# EAGLE design O2_PROM_ISP_FFC_L_A00 (EAGLE 9.6.2)
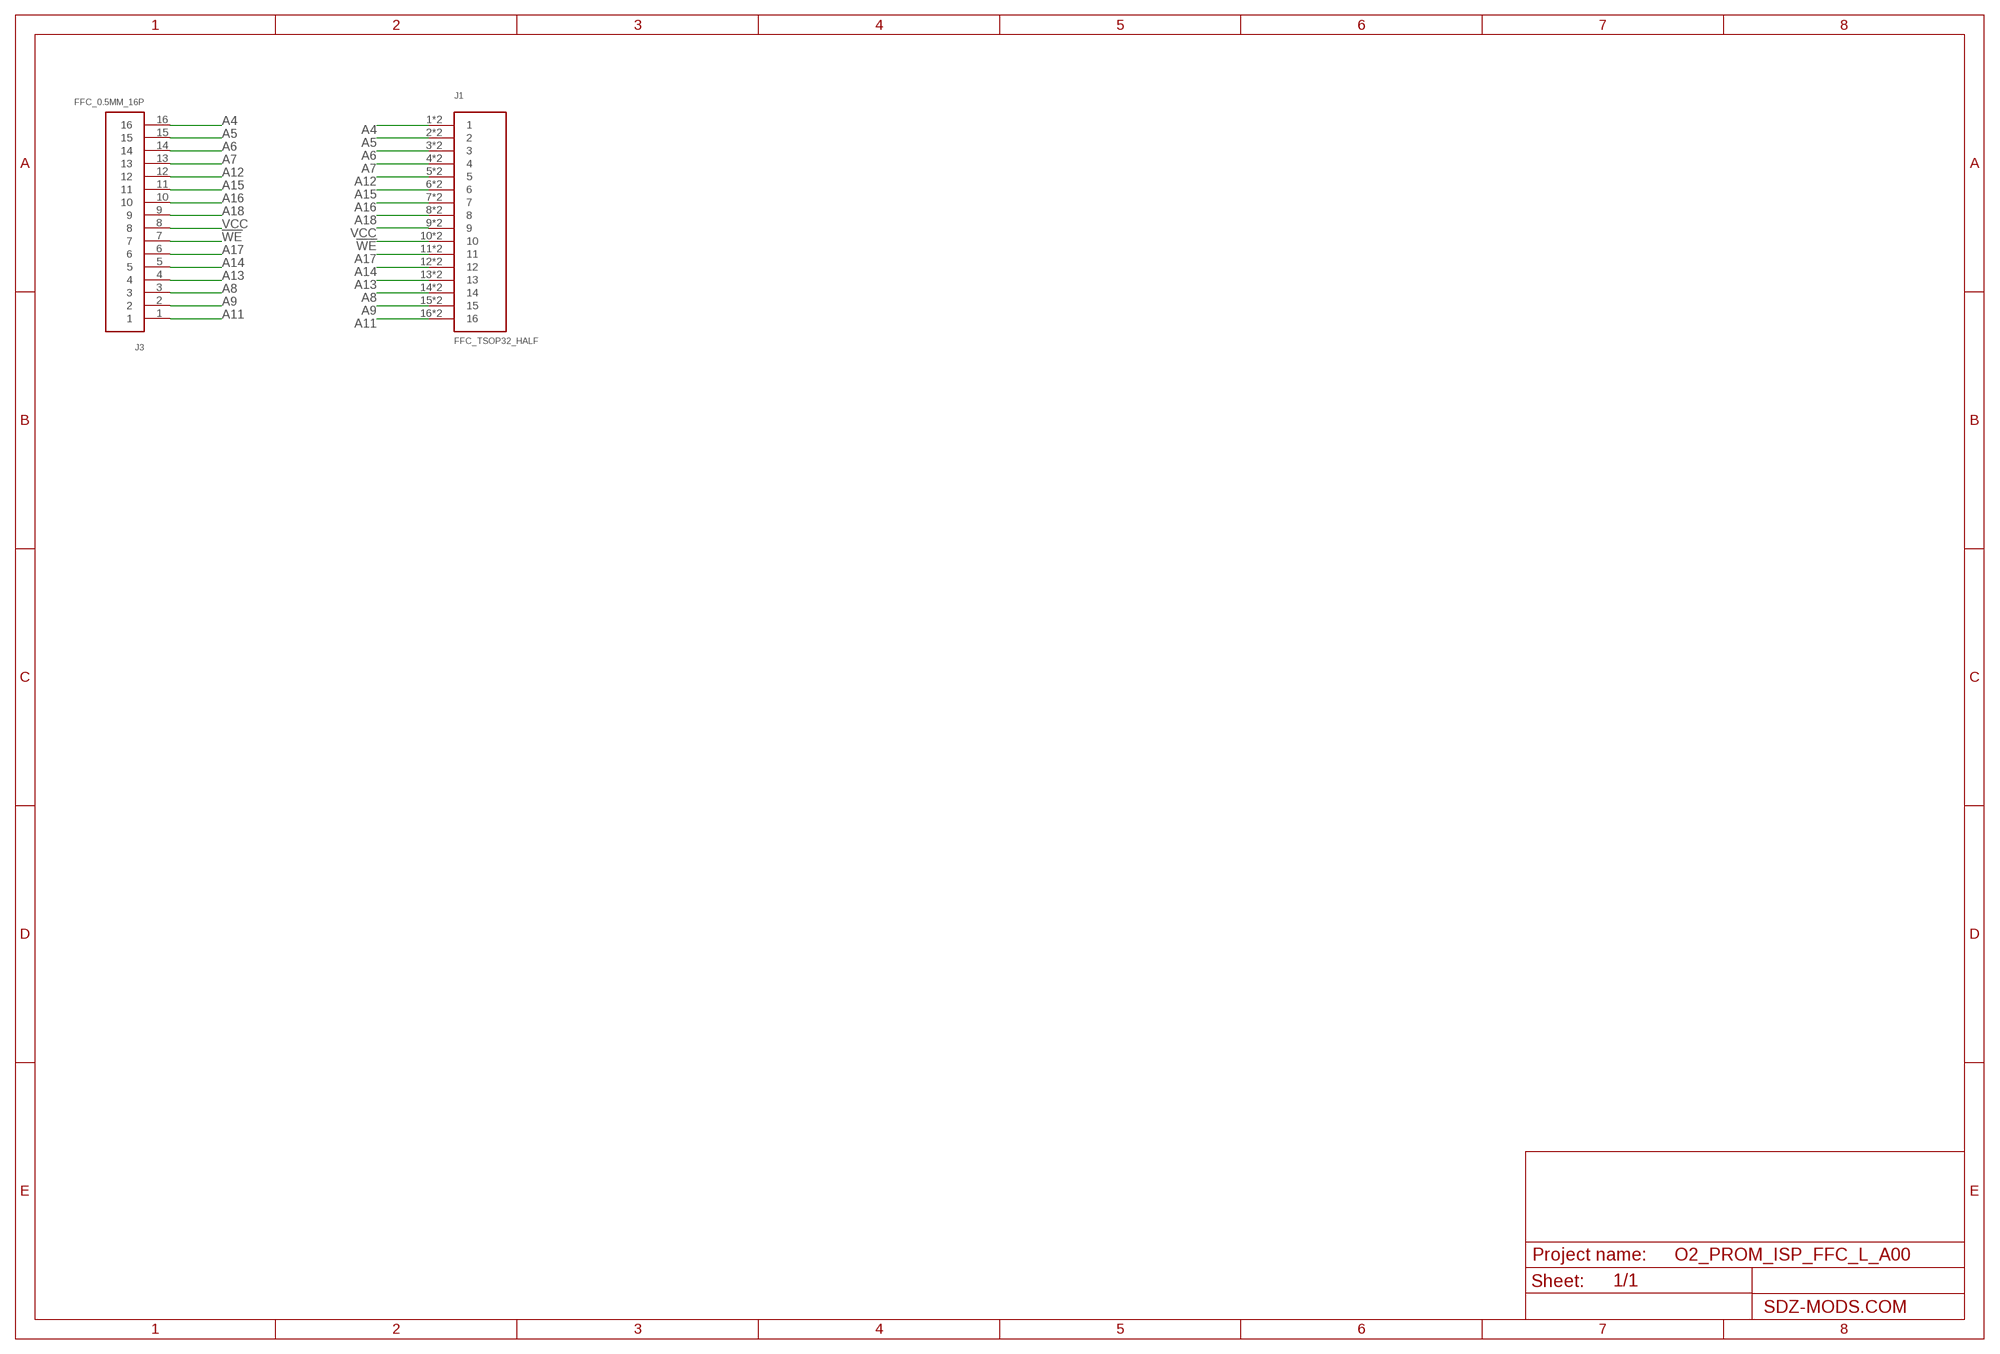
[diagram p0: schematic, sheet 1]

## Parts
J1  FFC_TSOP32_HALF  [FFC_TSOP32_HALF]
J3  FFC_0.5MM_16P  [FFC_0.5MM_16P]

## Nets
!WE: J1.10 J1.10A J3.7
A4: J1.1 J1.1A J3.16
A5: J1.2 J1.2A J3.15
A6: J1.3 J1.3A J3.14
A7: J1.4 J1.4A J3.13
A8: J1.14 J1.14A J3.3
A9: J1.15 J1.15A J3.2
A11: J1.16 J1.16A J3.1
A12: J1.5 J1.5A J3.12
A13: J1.13 J1.13A J3.4
A14: J1.12 J1.12A J3.5
A15: J1.6 J1.6A J3.11
A16: J1.7 J1.7A J3.10
A17: J1.11 J1.11A J3.6
A18: J1.8 J1.8A J3.9
VCC: J1.9 J1.9A J3.8

## Library data of the parts
J1 = FFC_TSOP32_HALF:FFC_TSOP32_HALF
J3 = FFC_05MM_16P:FFC_0.5MM_16P

## Board
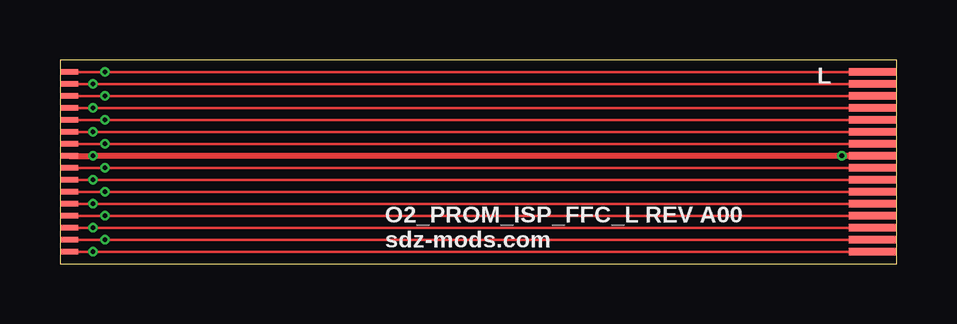
[diagram p1: board, top side]
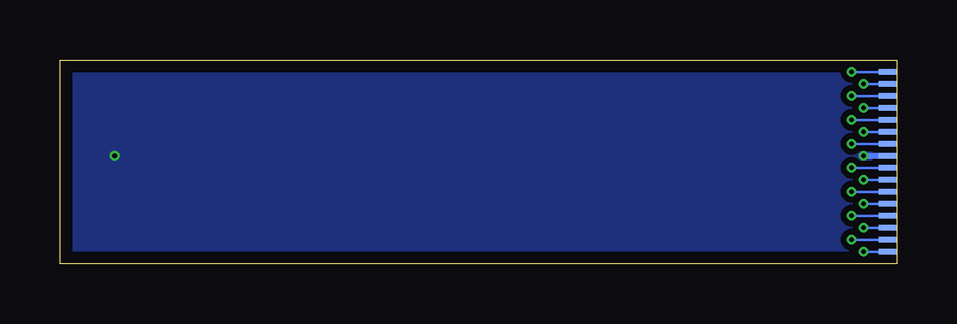
[diagram p2: board, bottom side, seen from below]

Size 34.88 x 8.5 mm. Coordinates in mm from the lower left corner, seen from the top.
Outline: 34.88,8.5 0,8.5 0,0 34.88,0 34.88,8.5
Copper layers (1*16): Top 0.035mm / dielectric 1.5mm / Bottom 0.035mm
Design rules "default *": minimum track width 0.1mm, minimum drill 0.15mm, track to track 0.1mm, track to pad 0.1mm, pad to pad 0.1mm, via to via 0.1mm, smd to smd 0.1mm, copper to edge 20mil, drill to drill 6mil, minimum pad ring 10mil, minimum via ring 0.1mm, stop-mask expansion 4mil, vias tented up to drill 0.35mm, thermal gap 10mil

### Footprints (pad centres in the part's own frame; a part is rotated, then mirrored left to right if it is on the bottom)
FFC_TSOP32_HALF = smd 0.75 x 0.22: 1 0,3.75; 2 0,3.25; 3 0,2.75; 4 0,2.25; 5 0,1.75; 6 0,1.25; 7 0,0.75; 8 0,0.25; 9 0,-0.25; 10 0,-0.75; 11 0,-1.25; 12 0,-1.75; 13 0,-2.25; 14 0,-2.75; 15 0,-3.25; 16 0,-3.75 | smd 0.75 x 0.22 bottom: 1A 0,3.75; 2A 0,3.25; 3A 0,2.75; 4A 0,2.25; 5A 0,1.75; 6A 0,1.25; 7A 0,0.75; 8A 0,0.25; 9A 0,-0.25; 10A 0,-0.75; 11A 0,-1.25; 12A 0,-1.75; 13A 0,-2.25; 14A 0,-2.75; 15A 0,-3.25; 16A 0,-3.75
FFC_0.5MM_16P = smd 2 x 0.3: 1 0,-3.75; 2 0,-3.25; 3 0,-2.75; 4 0,-2.25; 5 0,-1.75; 6 0,-1.25; 7 0,-0.75; 8 0,-0.25; 9 0,0.25; 10 0,0.75; 11 0,1.25; 12 0,1.75; 13 0,2.25; 14 0,2.75; 15 0,3.25; 16 0,3.75

### Placement (x,y rotation side)
J1  0.38,4.25 180 top
J3  33.88,4.25 180 top

### Tracks (layer width: path | path; a pad name or v marks a point on that pad's centre or on a via)
!WE  (via drill 0.2)
  Top 0.1: J1.10A v1.88,5 J3.7
  Bottom 0.1: J1.10A v1.88,5
A4  (via drill 0.2)
  Top 0.1: J1.1A v1.38,0.5 J3.16
  Bottom 0.1: J1.1A v1.38,0.5
A5  (via drill 0.2)
  Top 0.1: v1.88,1 0.56,1 | J1.2A v1.88,1 | J3.15 v1.88,1
  Bottom 0.1: J1.2A v1.88,1
A6  (via drill 0.2)
  Top 0.1: J1.3 v1.38,1.5 J3.14
  Bottom 0.1: J1.3 v1.38,1.5
A7  (via drill 0.2)
  Top 0.1: J1.4 v1.88,2 J3.13
  Bottom 0.1: J1.4 v1.88,2
A8  (via drill 0.2)
  Top 0.1: J1.14A v1.88,7 J3.3
  Bottom 0.1: J1.14A v1.88,7
A9  (via drill 0.2)
  Top 0.1: J1.15 v1.38,7.5 J3.2
  Bottom 0.1: J1.15 v1.38,7.5
A11  (via drill 0.2)
  Top 0.1: J1.16A v1.88,8 J3.1
  Bottom 0.1: J1.16A v1.88,8
A12  (via drill 0.2)
  Top 0.1: J1.5 v1.38,2.5 J3.12
  Bottom 0.1: J1.5 v1.38,2.5
A13  (via drill 0.2)
  Top 0.1: J1.13 v1.38,6.5 J3.4
  Bottom 0.1: J1.13 v1.38,6.5
A14  (via drill 0.2)
  Top 0.1: J1.12 v1.88,6 J3.5
  Bottom 0.1: J1.12 v1.88,6
A15  (via drill 0.2)
  Top 0.1: J1.6 v1.88,3 J3.11
  Bottom 0.1: J1.6 v1.88,3
A16  (via drill 0.2)
  Top 0.1: J1.7A v1.38,3.5 J3.10
  Bottom 0.1: J1.7A v1.38,3.5
A17  (via drill 0.2)
  Top 0.1: J1.11 v1.38,5.5 J3.6
  Bottom 0.1: J1.11 v1.38,5.5
A18  (via drill 0.2)
  Top 0.1: J1.8 v1.88,4 J3.9
  Bottom 0.1: J1.8 v1.88,4
VCC  (via drill 0.2)
  Top 0.254: J3.8 v32.59,4.5 v1.38,4.5 J1.9A
  Bottom 0.254: J1.9A v1.38,4.5
  pour Bottom (isolate 0.25): 35.12,-0.4 -0.75,-0.4 -0.75,8.9 35.12,8.9

### Text on the board
tPlace: L | O2_PROM_ISP_FFC_L REV A00 / sdz-mods.com
stiffener: 4x8.5mm stiffener / Stiffener material: polyimide / Stiffener thickness: 0.2mm / Final thickness: 0.29-0.34mm